# Altium schematic sheet gps_blk.SchDoc
size A4; Engineer: JBayalas; DocumentNumber: 4; Revision: V4.3.0; SheetNumber: 4; SheetTotal: 12
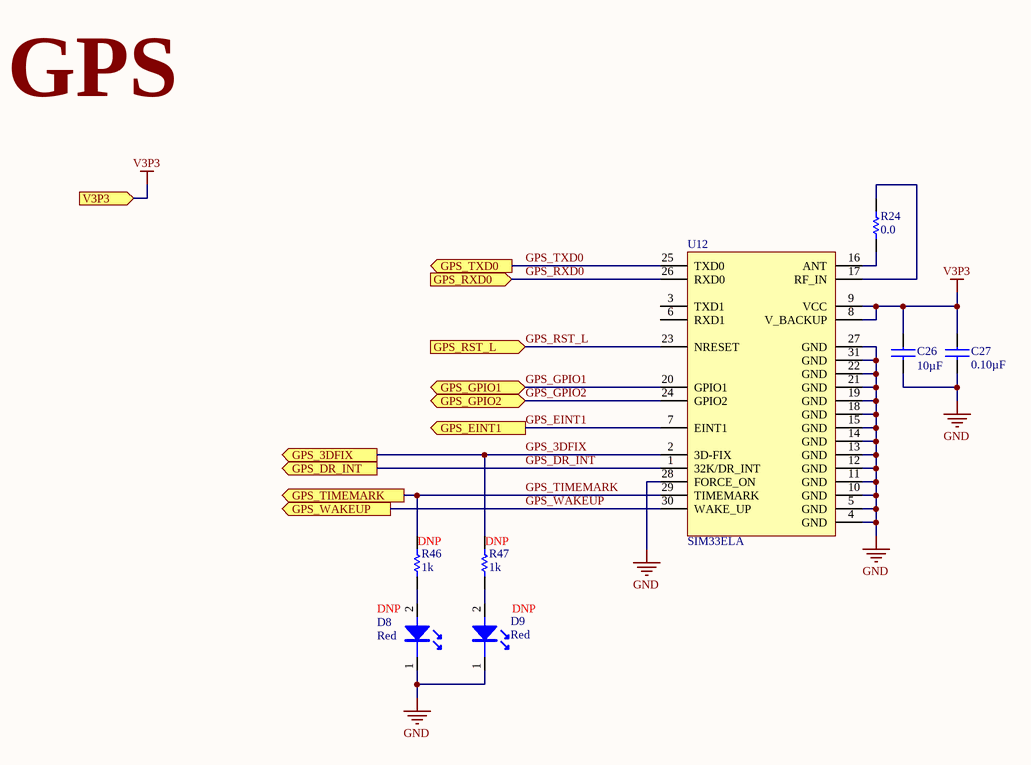
[diagram p0: gps_blk.SchDoc]

## Parts
C26  value 10µF  [C1206]  (hidden comment: GRM31CR71C106KAC7L)
C27  value 0.10µF  [C0402]  (hidden comment: GRM155R71H104ME14D)
D8  value Red  LOAD: DNP  [LED0402(RED)]  (hidden comment: VLMS1500-GS08)
D9  value Red  LOAD: DNP  [LED0402(RED)]  (hidden comment: VLMS1500-GS08)
R24  value 0.0  [R0603]  (hidden comment: CRCW06030000Z0EA)
R46  value 1k  LOAD: DNP  [R0402]  (hidden comment: ERJ-2RKF1001X)
R47  value 1k  LOAD: DNP  [R0402]  (hidden comment: ERJ-2RKF1001X)
U12  SIM33ELA  [SIM33ELA]

## Ports
GPS_3DFIX (out), GPS_DR_INT (out), GPS_EINT1 (out), GPS_GPIO1 (bidir), GPS_GPIO2 (bidir), GPS_RST_L (in), GPS_RXD0 (in), GPS_TIMEMARK (out), GPS_TXD0 (out), GPS_WAKEUP (out), V3P3 (in)

## Nets
GND: C26.2 C27.2 D8.1 D9.1 U12.4(GND) U12.5(GND) U12.10(GND) U12.11(GND) U12.12(GND) U12.13(GND) U12.14(GND) U12.15(GND) U12.18(GND) U12.19(GND) U12.21(GND) U12.22(GND) U12.27(GND) U12.28(FORCE_ON) U12.31(GND)
V3P3: C26.1 C27.1 U12.8(V_BACKUP) U12.9(VCC) ; port V3P3
GPS_3DFIX: R47.2 U12.2(3D-FIX) ; port GPS_3DFIX
GPS_DR_INT: U12.1(32K/DR_INT) ; port GPS_DR_INT
GPS_EINT1: U12.7(EINT1) ; port GPS_EINT1
GPS_GPIO1: U12.20(GPIO1) ; port GPS_GPIO1
GPS_GPIO2: U12.24(GPIO2) ; port GPS_GPIO2
GPS_RST_L: U12.23(NRESET) ; port GPS_RST_L
GPS_RXD0: U12.26(RXD0) ; port GPS_RXD0
GPS_TIMEMARK: R46.2 U12.29(TIMEMARK) ; port GPS_TIMEMARK
GPS_TXD0: U12.25(TXD0) ; port GPS_TXD0
GPS_WAKEUP: U12.30(WAKE_UP) ; port GPS_WAKEUP
NetD8_2: D8.2 R46.1
NetD9_2: D9.2 R47.1
NetR24_1: R24.1 U12.16(ANT)
NetR24_2: R24.2 U12.17(RF_IN)

Not connected (* = marked no-connect by the designer): U12 3(TXD1) 6(RXD1)

## Notes on the sheet
- GPS
- Title:
- Sheet:
- Date:
- of
- Project:
- Revision:
- Engineer:
- WI4B S.r.l

## Library data of the parts
C26 = GRM31CR71C106KAC7L: CAP CER 10UF 16V X7R 1206; MFT: Murata Electronics North America; TYPE: SMD; FUNCTION: gps; MPN: GRM31CR71C106KAC7L; RATING: 16V; DNP: *
C27 = GRM155R71H104ME14D: CAP CER 0.1UF 50V X7R 0402; MFT: Murata Electronics North America; TYPE: SMD; FUNCTION: gps; MPN: GRM155R71H104ME14D; RATING: 50V; DNP: *
D8 D9 = VLMS1500-GS08: LED RED 0402 SMD; ALT MPN1: YLS0402/R/21/05 C; MFT: Vishay Semiconductor Opto Division; ALT MFT1: Y.Lin Elect.; FUNCTION: gps; MPN: VLMS1500-GS08; TYPE: SMD; RATING: *; ALT DESC1: *
R24 = CRCW06030000Z0EA: RES SMD 0.0OHM JUMPER 1/10W 0603; MFT: Vishay Dale; RATING: 0.1W, 1/10W; FUNCTION: gps; MPN: CRCW06030000Z0EA; TYPE: Surface Mount
R46 R47 = ERJ-2RKF1001X: RES SMD 1K OHM 1% 1/10W 0402; MFT: Panasonic Electronic Components; RATING: 0.1W, 1/10W; FUNCTION: gps; MPN: ERJ-2RKF1001X; TYPE: Surface Mount; Parameter 1: *
U12 = SIM33ELA: A-GPS receiver, with built-in Antenna; ALT_MPN1: L96; MFT: SIMCom; ALT DESC1: RF TXRX MOD NAV INTEG/CHIP SMD; ALT MFT1: Quectel; FUNCTION: gps; VALUE: SIM33ELA; MPN: SIM33ELA